# Altium schematic sheet inst.SchDoc
size A
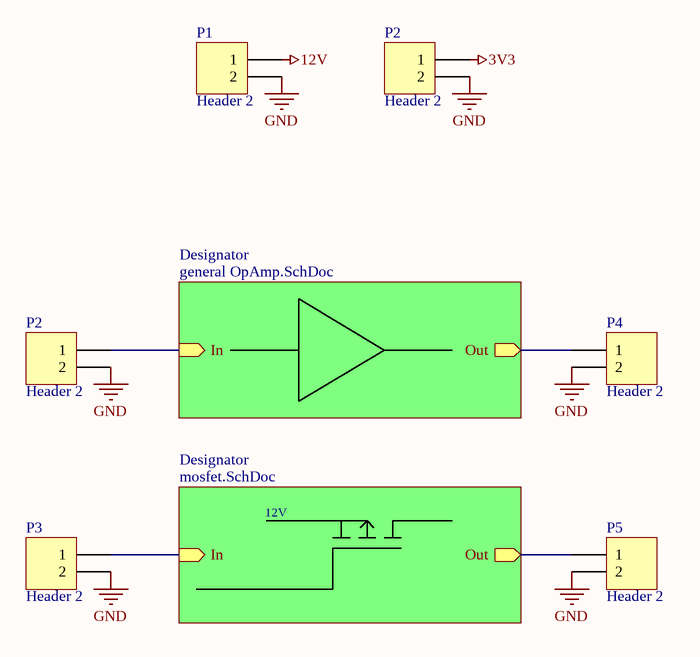
[diagram p0: inst.SchDoc]

## Parts
(Parts that share a designator on the sheet are numbered #1, #2 ... from top to bottom, then left to right.)
P1  Header 2  [HDR1X2]
P2#1  Header 2  [HDR1X2]
P2#2  Header 2  [HDR1X2]
P3  Header 2  [HDR1X2]
P4  Header 2  [HDR1X2]
P5  Header 2  [HDR1X2]

## Sub-sheets
Designator = general OpAmp.SchDoc: Out (out), In (in)
Designator = mosfet.SchDoc: In (in), Out (out)

## Nets
3V3: P2#1.1
12V: P1.1
GND: P1.2 P2#1.2 P2#2.2 P3.2 P4.2 P5.2
NetP2#2_1: P2#2.1 ; sheet Designator/In
NetP3_1: P3.1 ; sheet Designator/In
NetP4_1: P4.1 ; sheet Designator/Out
NetP5_1: P5.1 ; sheet Designator/Out

## Notes on the sheet
- 12V

## Library data of the parts
P1 P2#1 P2#2 P3-P5 = Header 2: Header, 2-Pin; LatestRevisionDate: 17-Jul-2002; LatestRevisionNote: Re-released for DXP Platform.; Publisher: Altium Limited